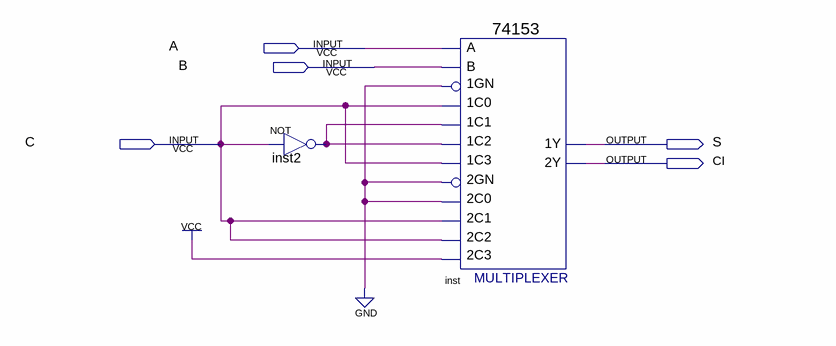
[diagram p0: schematic sheet]
// Quartus schematic FullAdd.bdf as structural Verilog: 2 symbols, 5 pins
module FullAdd (
  input  A,
  input  B,
  input  C,
  output S,
  output CI
);

  wire inst2_out;

  not inst2 (inst2_out, C);
  \74153  inst (
    .\1C1 (inst2_out), .\1GN (1'b0), .\1C0 (C), .\2C0 (1'b0), .\2GN (1'b0), .\2C2 (C), .\1C2 (inst2_out),
    .\1C3 (C), .B(B), .A(A), .\2C1 (C), .\2C3 (1'b1), .\1Y (S), .\2Y (CI));
endmodule
